# Altium schematic sheet Dac_Reference.SchDoc
size A
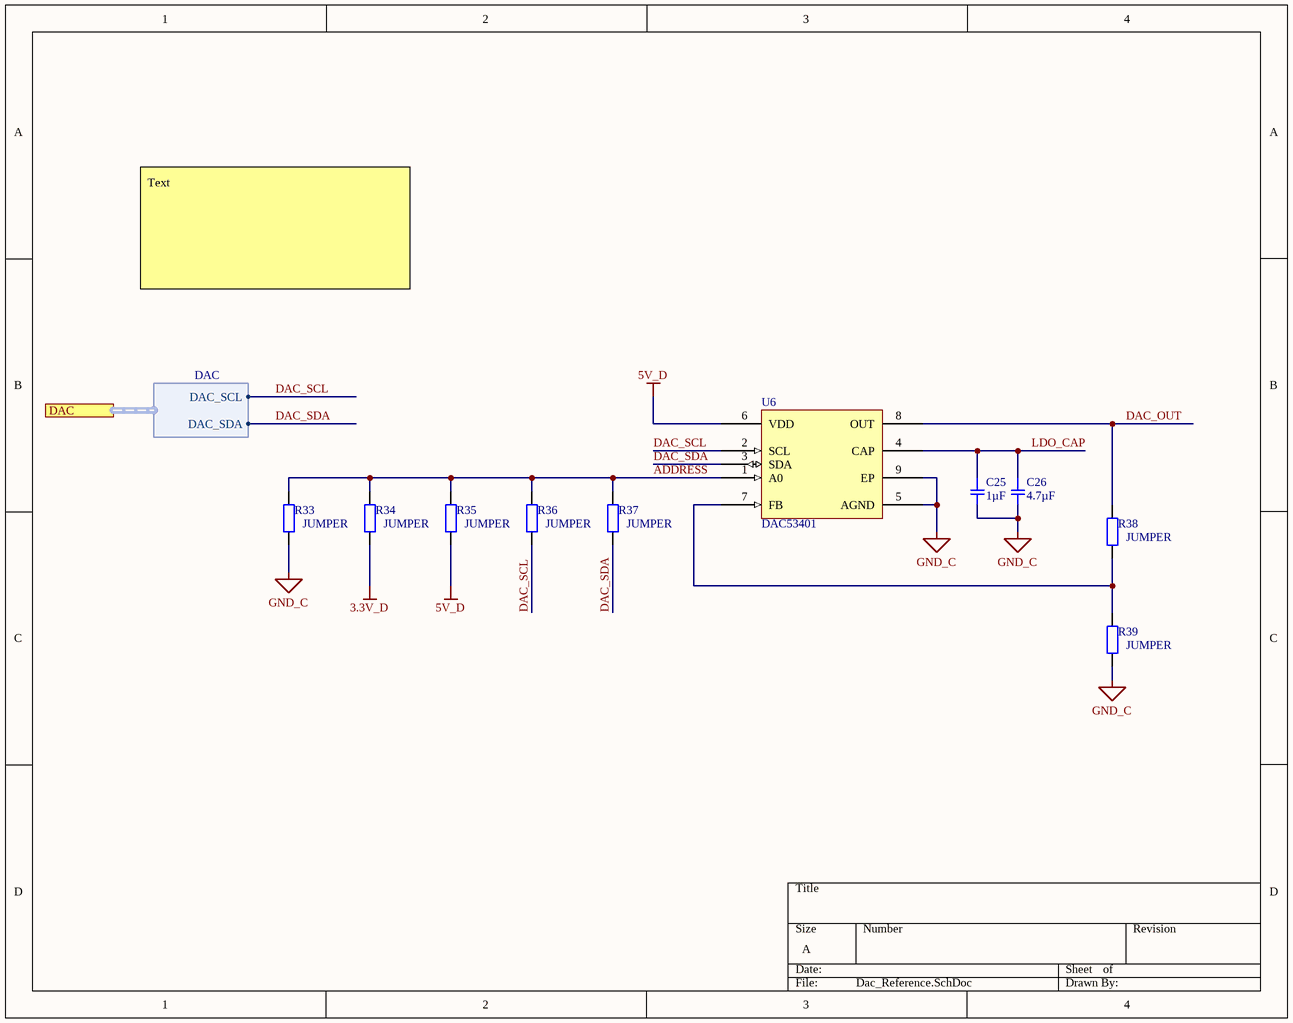
[diagram p0: Dac_Reference.SchDoc]

## Parts
C25  1µF  [SMD-0805C]
C26  4.7µF  [SMD-1206C]
R33  JUMPER  [WRIS-KSKE_0603_H=0.45mm]
R34  JUMPER  [WRIS-KSKE_0603_H=0.45mm]
R35  JUMPER  [WRIS-KSKE_0603_H=0.45mm]
R36  JUMPER  [WRIS-KSKE_0603_H=0.45mm]
R37  JUMPER  [WRIS-KSKE_0603_H=0.45mm]
R38  JUMPER  [WRIS-KSKE_0603_H=0.45mm]
R39  JUMPER  [WRIS-KSKE_0603_H=0.45mm]
U6  DAC53401  [SON50P200X80_HS-9N]

## Ports
DAC (harness DAC)

## Harnesses
DAC: DAC_SCL, DAC_SDA

## Nets
3.3V_D: R34.1
5V_D: R35.1 U6.6(VDD)
GND_C: C25.2 C26.2 R33.1 R39.1 U6.5(AGND) U6.9(EP)
ADDRESS: R33.2 R34.2 R35.2 R36.2 R37.2 U6.1(A0)
DAC_OUT: R38.2 U6.8(OUT)
DAC_SCL: R36.1 U6.2(SCL) ; port DAC.DAC_SCL
DAC_SDA: R37.1 U6.3(SDA) ; port DAC.DAC_SDA
LDO_CAP: C25.1 C26.1 U6.4(CAP)
NetR38_1: R38.1 R39.2 U6.7(FB)

## Notes on the sheet
- Text

## Library data of the parts
C25 = GCJ219R71C105KA01D: CAP CER 1UF 16V X7R 0805; Manufacturer: Murata Electronics North America; Factory Stock: 0; Unit Price (USD): 0.29; Minimum Quantity: 1; Tolerance: ±10%; Datasheets: http://www.murata.com/~/media/webrenewal/support/library/catalog/products/capacitor/mlcc/c03e.ashx; Image: //media.digikey.com/Renders/Murata%20Renders/0805%20(2012%20Metric)%20.85mm.jpg; Digi-Key Part Number: 490-5800-1-ND; Part Number: GCJ219R71C105KA01D; Quantity Available: 140338; @ qty: 0; Packaging: Cut Tape (CT); Series: GCJ; Part Status: Active; Value: 1µF; Voltage: 16V; Temperature Coefficient: X7R; Operating Temperature: -55°C ~ 125°C; Features: Soft Termination; Ratings: AEC-Q200; Applications: Automotive, Boardflex Sensitive; Mounting Type: Surface Mount, MLCC; Package / Case: 0805 (2012 Metric); Size / Dimension: 0.079" L x 0.049" W (2.00mm x 1.25mm); Height - Seated (Max): -; Thickness (Max): 0.037" (0.95mm); Lead Spacing: -; Lead Style: -
C26 = GCJ31CR71E475KA12L: CAP CER 4.7UF 25V X7R 1206; Manufacturer: Murata Electronics North America; Factory Stock: 0; Unit Price (USD): 0.65; Minimum Quantity: 1; Tolerance: ±10%; Datasheets: http://www.murata.com/~/media/webrenewal/support/library/catalog/products/capacitor/mlcc/c03e.ashx; Image: //media.digikey.com/Renders/Murata%20Renders/GR331BD72E473KW01L.jpg; Digi-Key Part Number: 490-5808-1-ND; Part Number: GCJ31CR71E475KA12L; Quantity Available: 31743; @ qty: 0; Packaging: Cut Tape (CT); Series: GCJ; Part Status: Active; Value: 4.7µF; Voltage: 25V; Temperature Coefficient: X7R; Operating Temperature: -55°C ~ 125°C; Features: Soft Termination; Ratings: AEC-Q200; Applications: Automotive, Boardflex Sensitive; Mounting Type: Surface Mount, MLCC; Package / Case: 1206 (3216 Metric); Size / Dimension: 0.126" L x 0.063" W (3.20mm x 1.60mm); Height - Seated (Max): -; Thickness (Max): 0.075" (1.90mm); Lead Spacing: -; Lead Style: -
R33-R39 = 560050316012: WRIS-KSKE Thick Film Resistors, size 0603, 10Ohm, +/-1%, 0.25W; Rated Current: 0.15A; Temperature Coefficient of Resistance: +/-100ppm/degC; Technical Reference: KE06030100F104KAATP0000; ComponentLink1Description: Manufacturer; ComponentLink1URL: http://www.we-online.de; ComponentLink2Description: Datasheet; ComponentLink2URL: https://katalog.we-online.com/pbs/datasheet/560050316012.pdf; Publisher: Wurth Elektronik; Rated Power: 0.25W; Resistance: 10Ohm; Mounting Technology: SMT; Height: 0.45mm; Part Number: 560050316012; Packaging: Tape and Reel; Published Date: September 2019; Size: 0603; Length: 1.6mm; Operating Temperature: -55 to +155degC; Resistance Tolerance: +/-1%; Width: 0.8mm
U6 = CMP-0000-53401-1: DACx3401 10-Bit and 8-Bit, Voltage-Output Digital-to-Analog Converters With Nonvolatile / Memory and PMBus™ Compatible I2C Interface